# EAGLE design xdac_A (EAGLE 7.7.0)
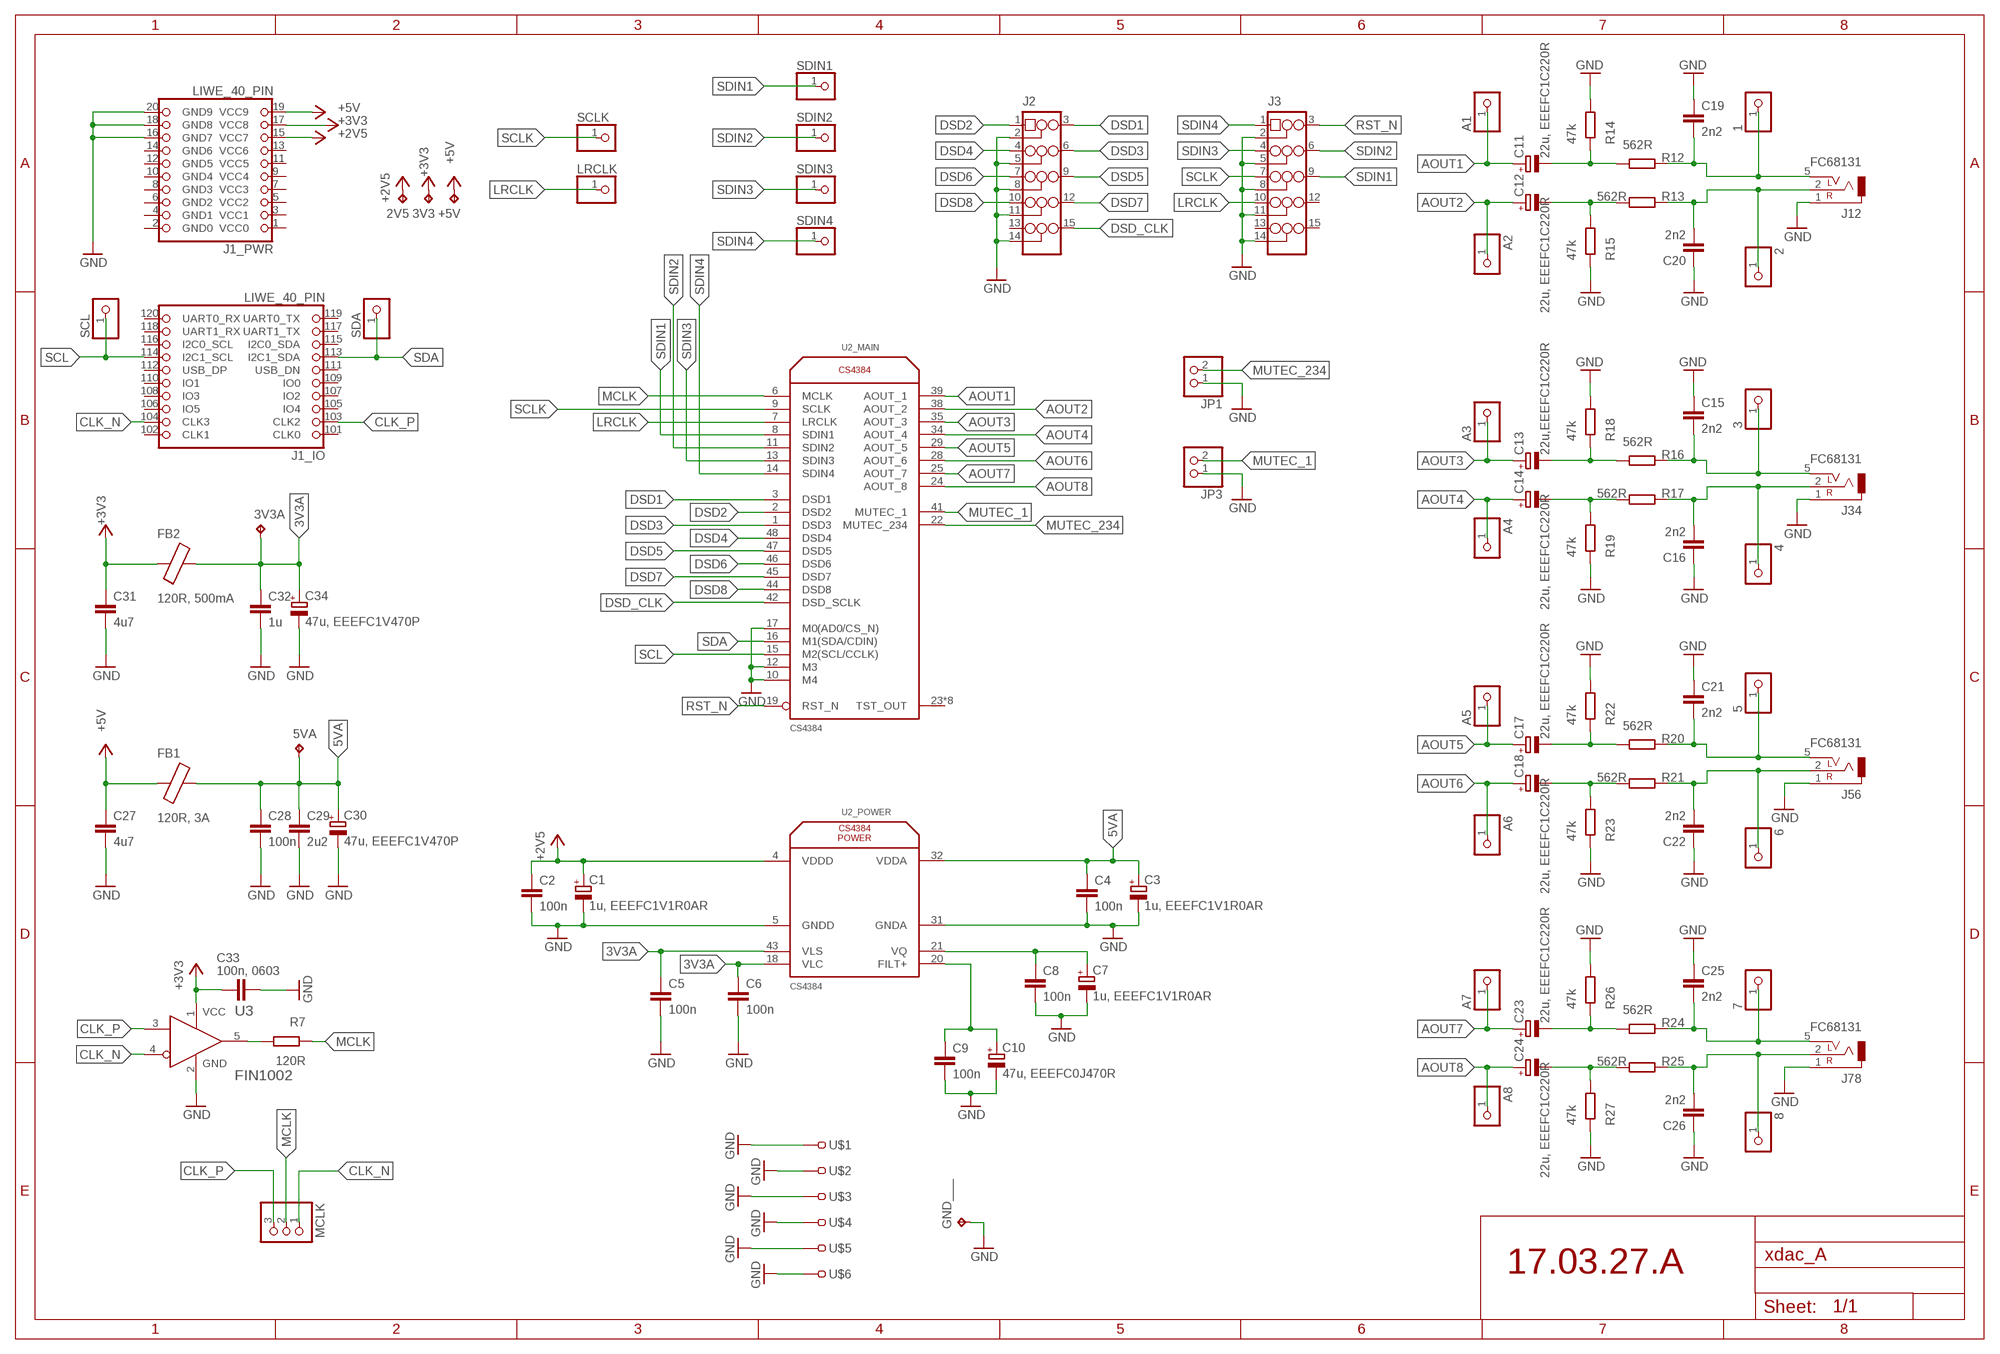
[diagram p0: schematic, sheet 1]

## Parts
1  PINHD-1X1  [1X01]
2  PINHD-1X1  [1X01]
2V5  TPTP14R  [TP14R]
3  PINHD-1X1  [1X01]
3V3  TPTP14R  [TP14R]
3V3A  TPTP14R  [TP14R]
4  PINHD-1X1  [1X01]
5  PINHD-1X1  [1X01]
5VA  TPTP14R  [TP14R]
6  PINHD-1X1  [1X01]
7  PINHD-1X1  [1X01]
8  PINHD-1X1  [1X01]
+5V  TPTP14R  [TP14R]
A1  PINHD-1X1  [1X01]
A2  PINHD-1X1  [1X01]
A3  PINHD-1X1  [1X01]
A4  PINHD-1X1  [1X01]
A5  PINHD-1X1  [1X01]
A6  PINHD-1X1  [1X01]
A7  PINHD-1X1  [1X01]
A8  PINHD-1X1  [1X01]
C1  1u, EEEFC1V1R0AR  C-POL_B  [EEE-FC1V1R0AR]
C2  100n  C-EUC0603  [C0603]
C3  1u, EEEFC1V1R0AR  C-POL_B  [EEE-FC1V1R0AR]
C4  100n  C-EUC0603  [C0603]
C5  100n  C-EUC0603  [C0603]
C6  100n  C-EUC0603K  [C0603K]
C7  1u, EEEFC1V1R0AR  C-POL_B  [EEE-FC1V1R0AR]
C8  100n  C-EUC0603  [C0603]
C9  100n  C-EUC0603  [C0603]
C10  47u, EEEFC0J470R  C-POL_C  [EEE-FC1C220R]
C11  22u, EEEFC1C220R  C-POL_C  [EEE-FC1C220R]
C12  22u, EEEFC1C220R  C-POL_C  [EEE-FC1C220R]
C13  22u,EEEFC1C220R  C-POL_C  [EEE-FC1C220R]
C14  22u, EEEFC1C220R  C-POL_C  [EEE-FC1C220R]
C15  2n2  C-EUC0603  [C0603]
C16  2n2  C-EUC0603  [C0603]
C17  22u, EEEFC1C220R  C-POL_C  [EEE-FC1C220R]
C18  22u, EEEFC1C220R  C-POL_C  [EEE-FC1C220R]
C19  2n2  C-EUC0603  [C0603]
C20  2n2  C-EUC0603  [C0603]
C21  2n2  C-EUC0603  [C0603]
C22  2n2  C-EUC0603  [C0603]
C23  22u, EEEFC1C220R  C-POL_C  [EEE-FC1C220R]
C24  22u, EEEFC1C220R  C-POL_C  [EEE-FC1C220R]
C25  2n2  C-EUC0603  [C0603]
C26  2n2  C-EUC0603  [C0603]
C27  4u7  C-EUC0603K  [C0603K]
C28  100n  C-EUC0603K  [C0603K]
C29  2u2  C-EUC0603K  [C0603K]
C30  47u, EEEFC1V470P  C-POL_E  [EEE-FC1V470P]
C31  4u7  C-EUC0603K  [C0603K]
C32  1u  C-EUC0603K  [C0603K]
C33  100n, 0603  C-EUC0603  [C0603]
C34  47u, EEEFC1V470P  C-POL_E  [EEE-FC1V470P]
FB1  120R, 3A  FB_0603  [L0603]
FB2  120R, 500mA  FB_0603  [L0603]
GND___  TPTP14R  [TP14R]
J1  LIWE_40_PIN  [LIWE_40_PIN_8X8]
J2  PINHD-3X5/90  [3X05/90]
J3  PINHD-3X5/90  [3X05/90]
J12  FC68131  JACK_3.5_3P  [FC68131]
J34  FC68131  JACK_3.5_3P  [FC68131]
J56  FC68131  JACK_3.5_3P  [FC68131]
J78  FC68131  JACK_3.5_3P  [FC68131]
JP1  PINHD-1X2/90  [1X02/90]
JP3  PINHD-1X2/90  [1X02/90]
LRCLK  PINHD-1X1  [1X01]
MCLK  PINHD-1X3  [1X03]
R7  120R  R-EU_R0603  [R0603]
R12  562R  R-EU_R0603  [R0603]
R13  562R  R-EU_R0603  [R0603]
R14  47k  R-EU_R0603  [R0603]
R15  47k  R-EU_R0603  [R0603]
R16  562R  R-EU_R0603  [R0603]
R17  562R  R-EU_R0603  [R0603]
R18  47k  R-EU_R0603  [R0603]
R19  47k  R-EU_R0603  [R0603]
R20  562R  R-EU_R0603  [R0603]
R21  562R  R-EU_R0603  [R0603]
R22  47k  R-EU_R0603  [R0603]
R23  47k  R-EU_R0603  [R0603]
R24  562R  R-EU_R0603  [R0603]
R25  562R  R-EU_R0603  [R0603]
R26  47k  R-EU_R0603  [R0603]
R27  47k  R-EU_R0603  [R0603]
SCL  PINHD-1X1  [1X01]
SCLK  PINHD-1X1  [1X01]
SDA  PINHD-1X1  [1X01]
SDIN1  PINHD-1X1  [1X01]
SDIN2  PINHD-1X1  [1X01]
SDIN3  PINHD-1X1  [1X01]
SDIN4  PINHD-1X1  [1X01]
U2  CS4384  [LQFP_48]
U3  FIN1002  [SOT95P280X140-5N]
U$1  TEST-22-MULTICOMP  [TEST_1MM]
U$2  TEST-22-MULTICOMP  [TEST_1MM]
U$3  TEST-22-MULTICOMP  [TEST_1MM]
U$4  TEST-22-MULTICOMP  [TEST_1MM]
U$5  TEST-22-MULTICOMP  [TEST_1MM]
U$6  TEST-22-MULTICOMP  [TEST_1MM]

## Nets
3V3A: 3V3A.TP C5.1 C6.1 C32.1 C34.1(+) FB2.1 U2.18(_POWER:VLC) U2.43(_POWER:VLS)
5VA: 5VA.TP C3.1(+) C4.1 C28.1 C29.1 C30.1(+) FB1.1 U2.32(_POWER:VDDA)
+2V5: 2V5.TP C1.1(+) C2.1 J1.15(_PWR:VCC7) U2.4(_POWER:VDDD)
+3V3: 3V3.TP C31.1 C33.2 FB2.2 J1.17(_PWR:VCC8) U3.1(VCC)
+5V: +5V.TP C27.1 FB1.2 J1.19(_PWR:VCC9)
AOUT1: A1.1 C11.1(+) U2.39(_MAIN:AOUT_1)
AOUT2: A2.1 C12.1(+) U2.38(_MAIN:AOUT_2)
AOUT2_: 2.1 C20.2 J12.2 R13.2
AOUT3: A3.1 C13.1(+) U2.35(_MAIN:AOUT_3)
AOUT3_: 3.1 C15.2 J34.5 R16.2
AOUT4: A4.1 C14.1(+) U2.34(_MAIN:AOUT_4)
AOUT4_: 4.1 C16.2 J34.2 R17.2
AOUT5: A5.1 C17.1(+) U2.29(_MAIN:AOUT_5)
AOUT5_: 5.1 C21.2 J56.5 R20.2
AOUT6: A6.1 C18.1(+) U2.28(_MAIN:AOUT_6)
AOUT6_: 6.1 C22.2 J56.2 R21.2
AOUT7: A7.1 C23.1(+) U2.25(_MAIN:AOUT_7)
AOUT7_: 7.1 C25.2 J78.5 R24.2
AOUT8: A8.1 C24.1(+) U2.24(_MAIN:AOUT_8)
AOUT8_: 8.1 C26.2 J78.2 R25.2
AUOT1_: 1.1 C19.2 J12.5 R12.2
CLK_N: J1.104(_IO:CLK3) MCLK.1 U3.4(RIN-)
CLK_P: J1.103(_IO:CLK2) MCLK.3 U3.3(RIN+)
DSD1: J2.3 U2.3(_MAIN:DSD1)
DSD2: J2.1 U2.2(_MAIN:DSD2)
DSD3: J2.6 U2.1(_MAIN:DSD3)
DSD4: J2.4 U2.48(_MAIN:DSD4)
DSD5: J2.9 U2.47(_MAIN:DSD5)
DSD6: J2.7 U2.46(_MAIN:DSD6)
DSD7: J2.12 U2.45(_MAIN:DSD7)
DSD8: J2.10 U2.44(_MAIN:DSD8)
DSD_CLK: J2.15 U2.42(_MAIN:DSD_SCLK)
FILT+: C9.1 C10.1(+) U2.20(_POWER:FILT+)
GND: C1.2(-) C2.2 C3.2(-) C4.2 C5.2 C6.2 C7.2(-) C8.2 C9.2 C10.2(-) C15.1 C16.1 C19.1 C20.1 C21.1 C22.1 C25.1 C26.1 C27.2 C28.2 C29.2 C30.2(-) C31.2 C32.2 C33.1 C34.2(-) GND___.TP J1.16(_PWR:GND7) J1.18(_PWR:GND8) J1.20(_PWR:GND9) J2.2 J2.5 J2.8 J2.11 J2.14 J3.2 J3.5 J3.8 J3.11 J3.14 J12.1 J34.1 J56.1 J78.1 JP1.1 JP3.1 R14.2 R15.1 R18.2 R19.1 R22.2 R23.1 R26.2 R27.1 U2.5(_POWER:GNDD) U2.10(_MAIN:M4) U2.12(_MAIN:M3) U2.17(_MAIN:M0(AD0/CS_N)) U2.31(_POWER:GNDA) U3.2(GND) U$1.1 U$2.1 U$3.1 U$4.1 U$5.1 U$6.1
LRCLK: J3.10 LRCLK.1 U2.7(_MAIN:LRCLK)
MCLK: MCLK.2 R7.1 U2.6(_MAIN:MCLK)
MUTEC_1: JP3.2 U2.41(_MAIN:MUTEC_1)
MUTEC_234: JP1.2 U2.22(_MAIN:MUTEC_234)
N$7: R7.2 U3.5(ROUT)
N$15: C11.2(-) R12.1 R14.1
N$16: C12.2(-) R13.1 R15.2
N$27: C13.2(-) R16.1 R18.1
N$28: C14.2(-) R17.1 R19.2
N$33: C17.2(-) R20.1 R22.1
N$34: C18.2(-) R21.1 R23.2
N$39: C23.2(-) R24.1 R26.1
N$40: C24.2(-) R25.1 R27.2
RST_N: J3.3 U2.19(_MAIN:RST_N)
SCL: J1.114(_IO:I2C1_SCL) SCL.1 U2.15(_MAIN:M2(SCL/CCLK))
SCLK: J3.7 SCLK.1 U2.9(_MAIN:SCLK)
SDA: J1.113(_IO:I2C1_SDA) SDA.1 U2.16(_MAIN:M1(SDA/CDIN))
SDIN1: J3.9 SDIN1.1 U2.8(_MAIN:SDIN1)
SDIN2: J3.6 SDIN2.1 U2.11(_MAIN:SDIN2)
SDIN3: J3.4 SDIN3.1 U2.13(_MAIN:SDIN3)
SDIN4: J3.1 SDIN4.1 U2.14(_MAIN:SDIN4)
VQ: C7.1(+) C8.1 U2.21(_POWER:VQ)
Unconnected: J1.1(_PWR:VCC0) J1.2(_PWR:GND0) J1.3(_PWR:VCC1) J1.4(_PWR:GND1) J1.5(_PWR:VCC2) J1.6(_PWR:GND2) J1.7(_PWR:VCC3) J1.8(_PWR:GND3) J1.9(_PWR:VCC4) J1.10(_PWR:GND4) J1.11(_PWR:VCC5) J1.12(_PWR:GND5) J1.13(_PWR:VCC6) J1.14(_PWR:GND6) J1.101(_IO:CLK0) J1.102(_IO:CLK1) J1.105(_IO:IO4) J1.106(_IO:IO5) J1.107(_IO:IO2) J1.108(_IO:IO3) J1.109(_IO:IO0) J1.110(_IO:IO1) J1.111(_IO:USB_DN) J1.112(_IO:USB_DP) J1.115(_IO:I2C0_SDA) J1.116(_IO:I2C0_SCL) J1.117(_IO:UART1_TX) J1.118(_IO:UART1_RX) J1.119(_IO:UART0_TX) J1.120(_IO:UART0_RX) J2.13 J3.12 J3.13 J3.15 U2.23(_MAIN:TST_OUT) U2.26(_MAIN:TST_OUT) U2.27(_MAIN:TST_OUT) U2.30(_MAIN:TST_OUT) U2.33(_MAIN:TST_OUT) U2.36(_MAIN:TST_OUT) U2.37(_MAIN:TST_OUT) U2.40(_MAIN:TST_OUT)

## Notes on the sheet
- 17.03.27.A

## Library data of the parts
1-8 A1-A8 LRCLK SCL SCLK SDA SDIN1-SDIN4 = 25pinhead:PINHD-1X1: PIN HEADER
2V5 3V3 3V3A 5VA +5V GND___ = testpad:TP: Test pad
C1 C3 C7 C10-C14 C17 C18 C23 C24 C30 C34 = 25cmsquare:C-POL: Panasonic Alluminium Electrolytic Capacitors / FC Series: FC Type: V http://www.farnell.com/datasheets/2059994.pdf?_ga=1.187970088.1293831445.1473845555
C2 C4-C6 C8 C9 C15 C16 C19-C22 C25-C29 C31-C33 = rcl:C-EU: CAPACITOR, European symbol
FB1 FB2 = 25cmsquare:FB
J1 = 25cmsquare:LIWE_40_PIN
J2 J3 = 25pinhead:PINHD-3X5
J12 J34 J56 J78 = 25cmsquare:JACK_3.5_3P: CLIFF 3.5mm STEREO PC JACK SOCKET http://www.farnell.com/datasheets/2028381.pdf?_ga=1.192560682.1293831445.1473845555
JP1 JP3 = 25pinhead:PINHD-1X2: PIN HEADER
MCLK = 25pinhead:PINHD-1X3: PIN HEADER
R7 R12-R27 = rcl:R-EU_: RESISTOR, European symbol
U2 = 25cmsquare:CS4384
U3 = 25cmsquare:FIN1002
U$1-U$6 = 25cmsquare:TEST-22-MULTICOMP: MULTICOMP TEST-22 TEST PIN, PCB, 1.0MM FARNELL: 1702010

## Board
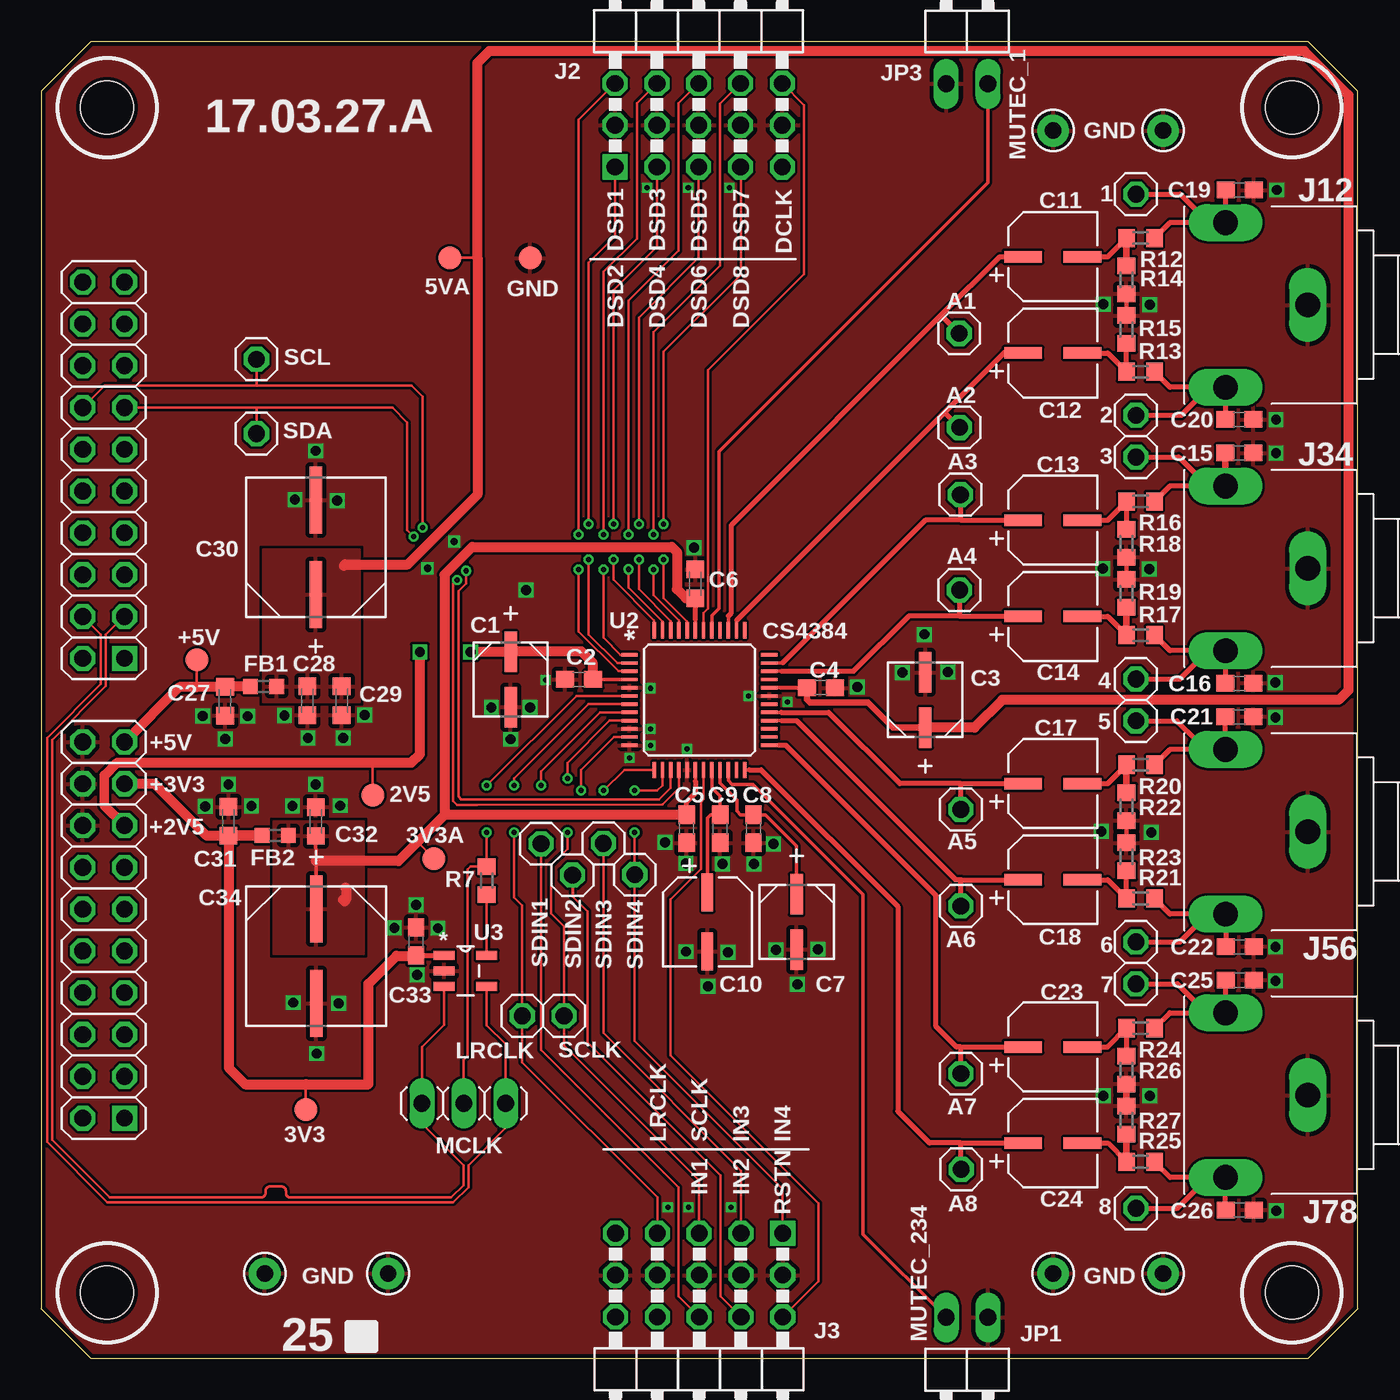
[diagram p1: board, top side]
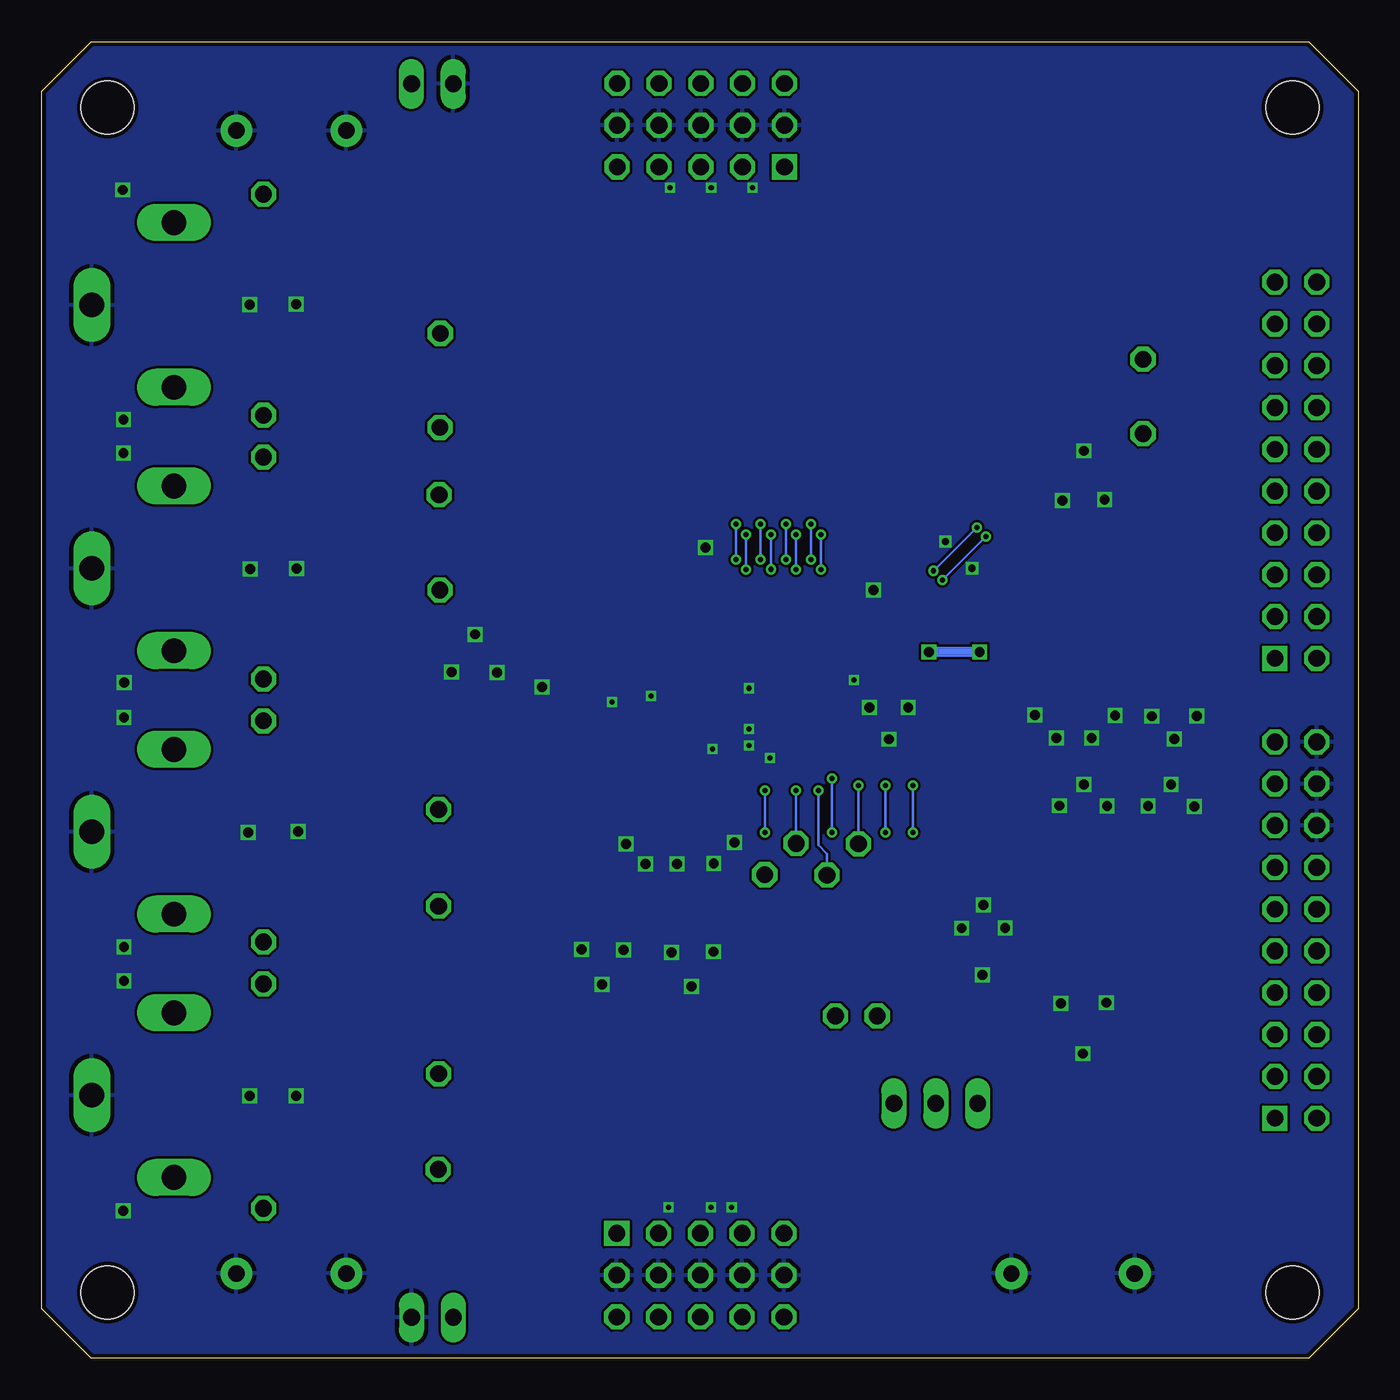
[diagram p2: board, bottom side, seen from below]

Size 80 x 80 mm. Coordinates in mm from the lower left corner, seen from the top.
Copper layers (1*16): Top 0.035mm / dielectric 1.5mm / Bottom 0.035mm
Design rules "SeeedStudio_2layer_DRU_no_angle_20140221": minimum track width 6mil, minimum drill 12mil, track to track 6mil, track to pad 6mil, pad to pad 6mil, via to via 6mil, smd to smd 0mil, copper to edge 10mil, drill to drill 10mil, minimum pad ring 10mil, minimum via ring 6mil, stop-mask expansion 2mil, vias tented up to drill 100mil, thermal gap 10mil

### Footprints (pad centres in the part's own frame; a part is rotated, then mirrored left to right if it is on the bottom)
1X01 = drill 1.016 octagon: 1 0,0
TP14R = smd 1.4 x 1.4: TP 0,0
EEE-FC1V1R0AR = smd 2.464 x 0.762: 1 -1.676,0; 2 1.676,0
C0603 = smd 1.1 x 1: 1 -0.85,0; 2 0.85,0
C0603K = smd 1.05 x 1.08: 1 -0.875,0; 2 0.875,0
EEE-FC1C220R = smd 2.3 x 0.7: 1 -1.8,0; 2 1.8,0
EEE-FC1V470P = smd 4.064 x 0.762: 1 -2.87,0; 2 2.87,0
L0603 = smd 0.9 x 0.9: 1 -0.8,0; 2 0.8,0
LIWE_40_PIN_8X8 = drill 1.016 square: 1 74.93,65.405; 101 74.93,37.465 | drill 1.016 octagon: 2 77.47,65.405; 3 74.93,62.865; 4 77.47,62.865; 5 74.93,60.325; 6 77.47,60.325; 7 74.93,57.785; 8 77.47,57.785; 9 74.93,55.245; 10 77.47,55.245; 11 74.93,52.705; 12 77.47,52.705; 13 74.93,50.165; 14 77.47,50.165; 15 74.93,47.625; 16 77.47,47.625; 17 74.93,45.085; 18 77.47,45.085; 19 74.93,42.545; 20 77.47,42.545; 102 77.47,37.465; 103 74.93,34.925; 104 77.47,34.925; 105 74.93,32.385; 106 77.47,32.385; 107 74.93,29.845; 108 77.47,29.845; 109 74.93,27.305; 110 77.47,27.305; 111 74.93,24.765; 112 77.47,24.765; 113 74.93,22.225; 114 77.47,22.225; 115 74.93,19.685; 116 77.47,19.685; 117 74.93,17.145; 118 77.47,17.145; 119 74.93,14.605; 120 77.47,14.605 | hole 3.2: 4,76; 4,4; 76,4; 76,76
3X05/90 = drill 1.016 square: 1 -5.08,-7.62 | drill 1.016 octagon: 2 -5.08,-5.08; 3 -5.08,-2.54; 4 -2.54,-7.62; 5 -2.54,-5.08; 6 -2.54,-2.54; 7 0,-7.62; 8 0,-5.08; 9 0,-2.54; 10 2.54,-7.62; 11 2.54,-5.08; 12 2.54,-2.54; 13 5.08,-7.62; 14 5.08,-5.08; 15 5.08,-2.54
FC68131 = drill 1.5 long: 1 0,0; 2 5,5; 5 5,-5
1X02/90 = drill 1.016 long: 1 -1.27,-3.81; 2 1.27,-3.81
1X03 = drill 1.016 long: 1 -2.54,0; 2 0,0; 3 2.54,0
R0603 = smd 1 x 1.1: 1 -0.85,0; 2 0.85,0
LQFP_48 = smd 0.2 x 1: 1 -2.75,-4.25; 2 -2.25,-4.25; 3 -1.75,-4.25; 4 -1.25,-4.25; 5 -0.75,-4.25; 6 -0.25,-4.25; 7 0.25,-4.25; 8 0.75,-4.25; 9 1.25,-4.25; 10 1.75,-4.25; 11 2.25,-4.25; 12 2.75,-4.25; 25 2.75,4.25; 26 2.25,4.25; 27 1.75,4.25; 28 1.25,4.25; 29 0.75,4.25; 30 0.25,4.25; 31 -0.25,4.25; 32 -0.75,4.25; 33 -1.25,4.25; 34 -1.75,4.25; 35 -2.25,4.25; 36 -2.75,4.25 | smd 1 x 0.2: 13 4.25,-2.75; 14 4.25,-2.25; 15 4.25,-1.75; 16 4.25,-1.25; 17 4.25,-0.75; 18 4.25,-0.25; 19 4.25,0.25; 20 4.25,0.75; 21 4.25,1.25; 22 4.25,1.75; 23 4.25,2.25; 24 4.25,2.75; 37 -4.25,2.75; 38 -4.25,2.25; 39 -4.25,1.75; 40 -4.25,1.25; 41 -4.25,0.75; 42 -4.25,0.25; 43 -4.25,-0.25; 44 -4.25,-0.75; 45 -4.25,-1.25; 46 -4.25,-1.75; 47 -4.25,-2.25; 48 -4.25,-2.75
SOT95P280X140-5N = smd 1.27 x 0.559: 1 -1.295,0.94; 2 -1.295,0; 3 -1.295,-0.94; 4 1.295,-0.94; 5 1.295,0.94
TEST_1MM = drill 1 pad 1.93: 1 0,0

### Placement (x,y rotation side)
1  66.52,70.74 0 top
2  66.52,57.3 0 top
2V5  20.17,34.21 0 top
3  66.52,54.76 0 top
3V3  16.08,15.11 0 top
3V3A  23.85,30.35 0 top
4  66.52,41.27 0 top
5  66.52,38.73 0 top
5VA  24.84,66.88 0 top
6  66.52,25.3 0 top
7  66.52,22.76 0 top
8  66.52,9.12 0 top
+5V  9.47,42.44 0 top
A1  55.78,62.28 0 top
A2  55.8,56.57 0 top
A3  55.85,52.48 0 top
A4  55.8,46.69 0 top
A5  55.88,33.35 0 top
A6  55.88,27.48 0 top
A7  55.88,17.3 0 top
A8  55.91,11.48 0 top
C1  28.52,41.25 270 top
C2  32.69,41.25 180 top
C3  53.72,40.01 90 top
C4  47.37,40.74 0 top
C5  39.22,32.18 270 top
C6  39.75,47.07 90 top
C7  45.9,26.52 270 top
C8  43.28,32.18 270 top
C9  41.25,32.18 270 top
C10  40.49,26.52 270 top
C11  61.47,66.93 0 top
C12  61.47,61.09 0 top
C13  61.47,50.93 0 top
C14  61.47,45.09 0 top
C15  72.8,55.02 180 top
C16  72.8,41.02 180 top
C17  61.47,34.92 0 top
C18  61.47,29.08 0 top
C19  72.82,70.99 180 top
C20  72.8,57.05 180 top
C21  72.8,38.99 180 top
C22  72.82,25.02 180 top
C23  61.47,18.92 0 top
C24  61.47,13.08 0 top
C25  72.82,22.99 180 top
C26  72.82,9.02 180 top
C27  11.18,39.93 270 top
C28  16.18,39.95 270 top
C29  18.26,39.95 270 top
C30  16.69,49.28 90 top
C31  11.38,32.64 90 top
C32  16.69,32.61 90 top
C33  22.78,25.32 270 top
C34  16.71,24.43 270 top
FB1  13.51,40.82 180 top
FB2  14.22,31.78 180 top
GND___  29.72,66.85 0 top
J1  80,80 180 top
J2  39.95,80.01 0 top
J3  39.98,-0.03 180 top
J12  76.96,64.01 180 top
J34  76.96,48 180 top
J56  76.96,32 180 top
J78  76.96,15.99 180 top
JP1  56.26,-1.32 180 top
JP3  56.26,81.25 0 top
LRCLK  29.24,20.8 0 top
MCLK  25.68,15.49 180 top
R7  27.08,29.03 270 top
R12  66.8,68.07 0 top
R13  66.8,59.94 0 top
R14  65.94,65.53 270 top
R15  65.94,62.51 270 top
R16  66.8,52.07 0 top
R17  66.8,43.94 0 top
R18  65.94,49.53 270 top
R19  65.94,46.48 270 top
R20  66.8,36.07 0 top
R21  66.8,27.94 0 top
R22  65.94,33.53 270 top
R23  65.94,30.48 270 top
R24  66.8,20.07 0 top
R25  66.8,11.94 0 top
R26  65.94,17.53 270 top
R27  65.94,14.48 270 top
SCL  13.08,60.71 0 top
SCLK  31.78,20.8 0 top
SDA  13.08,56.18 0 top
SDIN1  30.38,31.27 0 top
SDIN2  32.28,29.36 0 top
SDIN3  34.16,31.29 0 top
SDIN4  36.07,29.39 0 top
U2  40,40 270 top
U3  25.78,23.55 0 top
U$1  68.17,5.16 0 top
U$2  61.49,5.16 0 top
U$3  68.17,74.6 0 top
U$4  61.49,74.6 0 top
U$5  13.59,5.16 0 top
U$6  21.08,5.16 0 top

### Tracks (layer width: path | path; a pad name or v marks a point on that pad's centre or on a via)
3V3A
  Top 0.152: 3V3A.TP 23.85,30.38 22.86,31.37
  Top 0.203: C34.1 16.71,28.57 16.7,30.22 C32.1 | C5.1 39.18,32.99 | U2.18 39.75,35.08 | U2.43 39.75,44.91
  Top 0.305: C5.1 39.22,33.81 39.75,34.34 39.75,35.08 | 39.75,44.91 C6.1
  Top 0.61: C6.1 39.18,46.19 38.63,46.74 38.63,49 38.33,49.3 26.19,49.3 24.51,47.62 24.51,33.02 | C5.1 39.21,33.02 24.51,33.02 | 16.71,28.57 | 18.49,28.6 18.52,28.57 18.52,27.86 18.44,27.79 18.41,27.79 18.34,27.86 | 24.51,33.02 22.86,31.37 21.71,30.22 16.7,30.22
  pour Top: 14.12,32.61 19.58,32.61 19.58,24.56 14.12,24.56
5VA
  Top 0.152: 5VA.TP 26.52,66.88
  Top 0.203: C4.1 46.13,40.75 | U2.32 44.94,40.75
  Top 0.254: 44.94,40.75 46.13,40.75 arc-90 C4.1
  Top 0.406: C3.1 51.77,38.33 50.24,39.85 46.71,39.85 46.53,40.03 46.53,40.73 C4.1 46.15,40.73
  Top 0.61: C3.1 56.72,38.33 58.4,40.01 78.84,40.01 79.43,40.59 79.43,76.76 76.76,79.43 27.23,79.43 26.52,78.72 26.52,66.88 26.52,52.48 22.28,48.23 18.47,48.23 18.39,48.16
  pour Top: 13.49,39.88 19.35,39.88 19.35,49.15 13.49,49.15
+2V5  (via drill 0.6)
  Top 0.152: 2V5.TP 20.14,34.21 20.14,36.2
  Top 0.203: 28.57,42.98 C1.1 | 33.5,41.29 C2.1 U2.4 | U2.4
  Top 0.584: 3.83,33.6 3.83,35.38
  Top 0.61: 33.5,41.29 33.5,42.29 32.82,42.98 28.57,42.98 | J1.15 3.83,33.6 | 3.83,35.38 3.85,35.4 3.85,35.42 4.63,36.2 20.14,36.2 22.5,36.2 23.01,36.7 v23.01,42.93 | C1.1 v26.09,42.93
  Bottom 0.61: v23.01,42.93 v26.09,42.93
+3V3
  Top 0.152: 3V3.TP 16.08,16.66
  Top 0.305: C33.2 24.47,24.47 U3.1
  Top 0.61: J1.17 6.89,34.91 10.06,31.75 11.37,31.75 C31.1 13.41,31.76 FB2.2 11.4,31.77 11.4,17.65 12.39,16.66 16.08,16.66 19.89,16.66 19.89,22.76 21.59,24.46 C33.2 22.76,24.45
+5V
  Top 0.152: +5V.TP 9.45,42.44 9.45,40.78
  Top 0.203: C27.1
  Top 0.61: J1.19 8.4,40.78 9.45,40.78 11.15,40.78 C27.1 11.19,40.82 FB1.2
AOUT1
  Top 0.203: U2.39 41.75,45.11
  Top 0.254: C11.1 58.7,66.85
  Top 0.305: 41.75,45.11 41.94,45.3 41.94,50.62 54.69,63.37 | C11.1 58.24,66.93 54.69,63.37 | A1.1 54.69,63.37
AOUT2
  Top 0.203: U2.38 42.25,44.84
  Top 0.254: 58.75,61.11 C12.1
  Top 0.305: 54.88,57.47 42.25,44.84 | 54.88,57.47 58.52,61.11 58.75,61.11 | A2.1 54.9,57.47 54.88,57.47
AOUT2_
  Top 0.305: C20.2 71.95,59.01 70.38,59.01 | R13.2 68.59,59.01 70.38,59.01 | 2.1 69.29,57.3 70.38,58.4 70.38,59.01
  Top 0.406: J12.2 71.95,59.01
AOUT3
  Top 0.203: U2.35 45.04,42.25 45.06,42.27
  Top 0.254: C13.1 58.65,50.8
  Top 0.305: 45.06,42.27 53.72,50.93 55.91,50.93 | 55.91,50.93 C13.1 | A3.1 55.85,50.98 55.91,50.93
AOUT3_
  Top 0.305: R16.2 68.58,53 70.36,53 | 70.36,53 J34.5 | 3.1 69.11,54.76 70.36,53.52 70.36,53
  Top 0.406: C15.2 J34.5
AOUT4
  Top 0.203: U2.34 44.99,41.75
  Top 0.254: 58.75,45.11 C14.1
  Top 0.305: 44.99,41.75 49.37,41.75 52.73,45.11 55.78,45.11 | 55.78,45.11 58.75,45.11 | A4.1 55.8,45.14 55.78,45.11
AOUT4_
  Top 0.305: R17.2 68.59,43 70.33,43 | 70.33,43 J34.2 | 71.95,42.99 C16.2 | 4.1 69.19,41.27 70.33,42.42 70.33,43
  Top 0.406: J34.2 71.95,42.99
AOUT5
  Top 0.203: U2.29 44.96,39.25
  Top 0.305: 44.96,39.25 47.85,39.25 52.17,34.92 55.88,34.92 | 55.88,34.92 C17.1 | A5.1 55.88,34.92
AOUT5_
  Top 0.305: R20.2 68.58,37 70.21,37 | 70.21,37 J56.5 | 71.95,37.01 C21.2 | 5.1 69.01,38.73 70.21,37.54 70.21,37
  Top 0.406: J56.5 71.95,37.01
AOUT6
  Top 0.203: U2.28 44.98,38.75
  Top 0.305: 55.91,29.08 55.58,29.08 45.91,38.75 44.98,38.75 | 55.91,29.08 C18.1 | A6.1 55.88,29.06 55.91,29.08
AOUT6_
  Top 0.305: 71.97,27 C22.2 | R21.2 68.59,27 70.26,27 | 70.26,27 J56.2 | 6.1 69.19,25.3 70.26,26.36 70.26,27
  Top 0.406: J56.2 71.97,27
AOUT7
  Top 0.203: U2.25 44.82,37.25
  Top 0.305: 44.82,37.25 45.25,37.25 54.38,28.12 54.38,20.17 55.63,18.92 55.88,18.92 | 55.88,18.92 C23.1 | A7.1 55.88,18.92
AOUT7_
  Top 0.305: C25.2 J78.5 | R24.2 68.58,20.99 70.4,20.99 70.28,21.11 70.28,21.51 69.04,22.76 7.1
  Top 0.406: 70.4,20.99 J78.5 | C25.2
AOUT8
  Top 0.203: U2.24 42.76,35.76 43.03,35.76
  Top 0.305: 43.03,35.76 43.74,35.76 52.05,27.46 52.05,15.01 53.98,13.08 55.88,13.08 | 55.88,13.08 C24.1 | A8.1 55.88,11.51 55.88,13.08
AOUT8_
  Top 0.305: R25.2 68.6,10.99 70.28,10.99 | 70.28,10.99 J78.2 C26.2 | 8.1 69.04,9.12 70.28,10.36 70.28,10.99
  Top 0.406: C26.2
AUOT1_
  Top 0.305: R12.2 68.59,69.01 70.43,69.01 | 70.43,69.01 J12.5 | 71.97,69.02 C19.2 | 1.1 69.22,70.74 70.38,69.57 70.38,69.06 70.43,69.01
  Top 0.406: R12.2 | J12.5 71.97,69.02
CLK_N
  Top 0.152: J1.104 2.55,45.08 3.63,43.99 3.63,40.98 0.36,37.71 0.36,13.14 4.03,9.47 25.03,9.47 25.96,10.4 25.96,11.73 28.22,13.99 MCLK.1 28.22,19.1 27.08,20.24 U3.4
CLK_P
  Top 0.152: J1.103 5.02,45.08 3.94,43.99 3.94,40.86 0.66,37.58 0.66,13.27 4.15,9.78 13.37,9.78 arc90 13.64,10.05 13.64,10.18 arc-90 13.9,10.45 14.61,10.45 arc-90 14.87,10.18 14.87,10.05 arc90 15.14,9.78 24.91,9.78 25.65,10.53 25.65,11.73 23.14,14.25 MCLK.3 23.14,18.92 24.49,20.27 U3.3
DSD1  (via drill 0.3)
  Top 0.152: U2.3 35.09,41.75 32.66,44.17 v32.66,47.92 | J2.3 32.66,75.26 v32.66,50.06
  Bottom 0.152: v32.66,47.92 v32.66,50.06
DSD2  (via drill 0.3)
  Top 0.152: 35.73,42.27 U2.2 35.02,42.25 33.27,43.99 v33.27,48.54 | v33.27,50.7 33.27,66.57 34.87,68.17 J2.1
  Bottom 0.152: v33.27,48.54 v33.27,50.7
DSD3  (via drill 0.3)
  Top 0.152: U2.1 35.2,42.75 34.16,43.79 v34.16,47.92 | v34.16,50.06 34.16,66.02 36.2,68.05 36.2,76.25 J2.6
  Bottom 0.152: v34.16,47.92 v34.16,50.06
DSD4  (via drill 0.3)
  Top 0.152: 37.24,44.26 U2.48 37.25,44.84 34.77,47.32 v34.77,48.54 | v34.77,50.7 34.77,64.9 37.41,67.54 J2.4
  Bottom 0.152: v34.77,48.54 v34.77,50.7
DSD5  (via drill 0.3)
  Top 0.152: U2.47 37.75,44.77 35.69,46.84 v35.69,47.94 | v35.69,50.06 35.69,64.26 38.73,67.31 38.73,76.25 J2.9
  Bottom 0.152: v35.69,47.94 v35.69,50.06
DSD6  (via drill 0.3)
  Top 0.152: U2.46 38.25,44.81 36.32,46.74 v36.32,48.54 | v36.32,50.7 36.32,63.25 39.95,66.88 J2.7
  Bottom 0.152: v36.32,48.54 v36.32,50.7
DSD7  (via drill 0.3)
  Top 0.152: U2.45 38.75,44.84 37.21,46.38 v37.21,47.92 | 42.49,77.44 J2.12 41.25,76.22 41.25,66.4 37.21,62.36 v37.21,50.06
  Bottom 0.152: v37.21,47.92 v37.21,50.06
DSD8  (via drill 0.3)
  Top 0.152: U2.44 39.25,44.77 37.82,46.2 v37.82,48.54 | v37.82,50.7 37.82,61.16 42.52,65.86 42.52,72.36 J2.10
  Bottom 0.152: v37.82,48.54 v37.82,50.7
DSD_CLK
  Top 0.152: J2.15 46.35,76.15 46.35,65.89 40.52,60.05 40.52,45.57 40.25,45.3 U2.42
FILT+
  Top 0.203: U2.20 40.75,34.66 41.25,34.16 C9.1 | 41.24,33.02 C9.1 | C9.1 40.68,33.03 40.49,32.84 C10.1
GND  (via drill 0.3, 0.43, 0.6)
  Top 0.254: R14.2 R15.1 | R18.2 R19.1 | R22.2 R23.1 | 77.99,32 J56.1
  Top 0.406: R26.2 R27.1
  other vias: 36.8,71.15 39.32,71.15 41.83,71.15 39.34,9.17 41.91,9.17 38.07,9.17 37.03,40.72 30.66,41.22 37.03,38.25 37.03,37.24 39.24,37.03 42.98,40.23 75.08,70.99 75.03,57.05 75.03,55.02 74.98,41.07 75.01,38.94 75.01,24.99 75.01,22.94 75.06,8.97 67.36,15.95 64.54,15.95 67.46,31.95 64.41,32 67.34,47.96 64.52,47.98 67.36,64.03 64.54,64.06 49.61,40.79 52.32,41.68 53.67,43.99 55.09,41.71 41.73,24.66 44.65,24.82 47.19,24.84 45.95,22.73 39.19,24.71 40.51,22.61 43.31,30.05 41.4,30.05 37.9,31.34 39.67,49.28 35.76,36.47 45.34,39.88 15.27,33.55 18.16,33.58 12.78,33.55 11.38,34.87 9.8,39.04 9.96,33.53 16.69,34.87 11.18,37.64 12.55,39.01 16.21,37.69 18.34,37.69 14.78,39.07 19.66,39.09 15.32,21.62 18.08,21.56 16.74,18.52 16.69,55.14 17.98,52.12 15.42,52.17 27.36,39.55 29.72,39.55 28.52,37.62 22.78,27.56 24.1,26.14 21.46,26.16 22.83,23.29 23.47,48.01 25.1,49.63 44.5,31.27 39.17,30.07 29.46,46.69
  pour Bottom: -0.84,80.47 80.42,80.47 80.42,-0.05 -0.84,-0.05
  pour Top (rank 6): -2.03,81.69 81.2,81.69 81.2,-3.1 -2.03,-3.1
LRCLK  (via drill 0.3)
  Top 0.152: U2.7 33.25,39.75 28.73,35.23 v28.73,34.81 | J3.10 37.44,9.78 29.23,17.98 LRCLK.1 29.23,27.51 28.73,28.02 v28.73,31.95
  Bottom 0.152: v28.73,34.81 v28.73,31.95
MCLK  (via drill 0.3)
  Top 0.152: R7.1 27.07,29.87 | R7.1 v27.08,31.95 | R7.1 27.06,29.9 26.09,29.9 25.91,29.72 25.91,18.36 25.68,18.14 MCLK.2 | v27.08,34.8 32.53,40.25 U2.6
  Bottom 0.152: v27.08,34.8 v27.08,31.95
MUTEC_1
  Top 0.203: U2.41 40.75,45.14 41.17,45.57 41.17,55.09 57.53,71.45 JP3.2
MUTEC_234
  Top 0.152: 41.73,35.73 U2.22
  Top 0.203: U2.22 41.75,35.11 41.99,34.87 43.26,34.87 49.94,28.19 49.94,7.54 JP1.2
N$7
  Top 0.152: U3.5 R7.2
N$15
  Top 0.305: C11.2 64.81,66.93 R12.1
  Top 0.406: 63.75,66.93 C11.2 | R12.1 65.94,68.07 R14.1
N$16
  Top 0.305: 65.95,61.66 R13.1 64.81,61.09 C12.2
  Top 0.406: R15.2 65.95,61.66
N$27
  Top 0.305: 65.94,52.07 R18.1 | C13.2 64.81,50.93 R16.1
  Top 0.406: R16.1 65.94,52.07
N$28
  Top 0.305: C14.2 64.81,45.09 R17.1
  Top 0.406: R19.2 65.95,45.63 R17.1
N$33
  Top 0.305: C17.2 64.81,34.92 R20.1
  Top 0.406: R20.1 65.94,36.07 R22.1
N$34
  Top 0.305: 65.95,29.63 R21.1 64.81,29.08 C18.2
  Top 0.406: R23.2 65.95,29.63
N$39
  Top 0.305: 65.94,20.07 R26.1 | C23.2 64.81,18.92 R24.1
  Top 0.406: R24.1 65.94,20.07
N$40
  Top 0.305: C24.2 64.81,13.08 R25.1
  Top 0.406: R27.2 65.95,13.63 R25.1
RST_N
  Top 0.152: U2.19 40.25,33.98 40.08,33.81 40.08,29.74 38.23,27.89 38.23,18.41 47.22,9.42 47.22,4.67 J3.3
SCL  (via drill 0.3)
  Top 0.152: U2.15 38.25,34.67 37.54,33.96 25.53,33.96 25.35,34.14 25.35,46.61 25.83,47.09 v25.83,47.85 | v23.17,50.48 23.17,58.44 22.5,59.11 13.08,59.11 | J1.114 3.86,59.11 13.08,59.11 | 13.08,59.11 SCL.1
  Bottom 0.152: v25.83,47.85 25.79,47.85 v23.17,50.48
SCLK  (via drill 0.3)
  Top 0.152: U2.9 34.55,38.75 31.98,36.18 v31.98,35.23 | J3.7 39.98,10.82 31.77,19.02 SCLK.1 31.77,26.24 30.99,27.03 30.99,29.97 31.98,30.96 v31.98,31.95
  Bottom 0.152: v31.98,35.23 v31.98,31.95
SDA  (via drill 0.3)
  Top 0.152: U2.16 38.75,34.66 37.74,33.66 26.47,33.63 25.27,33.63 25.04,33.86 25.04,47.07 v25.27,47.3 | 13.08,57.77 21.35,57.77 22.25,56.87 22.25,50.32 v22.63,49.94 | 13.08,57.77 J1.113 | 13.08,57.77 SDA.1
  Bottom 0.152: v25.27,47.3 v22.63,49.94
SDIN1  (via drill 0.3)
  Top 0.152: U2.8 33.97,39.25 30.38,35.66 v30.38,34.8 | J3.9 38.73,3.76 38.73,10.39 30.38,18.75 SDIN1.1
  Bottom 0.152: v30.38,34.8 SDIN1.1
SDIN2  (via drill 0.3)
  Top 0.152: U2.11 34.8,37.75 32.82,35.76 v32.82,34.49 | J3.6 41.27,3.76 41.27,11.12 33.2,19.2 33.2,27.15 32.28,28.07 SDIN2.1 32.31,28.12
  Bottom 0.152: v32.82,34.49 32.82,31.19 32.28,30.66 SDIN2.1
SDIN3  (via drill 0.3)
  Top 0.152: J3.4 42.52,11.4 34.16,19.76 SDIN3.1 | v34.16,34.49 35.43,35.76 37.24,35.76
  Top 0.203: U2.13 37.24,35.76
  Bottom 0.152: v34.16,34.49 SDIN3.1
SDIN4  (via drill 0.3)
  Top 0.152: U2.14 37.75,34.82 37.42,34.49 v36.07,34.49 | J3.1 45.03,7.62 45.03,10.31 36.07,19.28 SDIN4.1 v36.07,31.95
  Bottom 0.152: v36.07,31.95 v36.07,34.49
VQ
  Top 0.152: U2.21
  Top 0.203: U2.21 41.25,34.95 42.27,33.93 42.27,33.25 42.48,33.03 C8.1 43.29,33.02 44.02,33.02 45.9,31.14 C7.1
  Top 0.254: 43.29,33.02 C8.1

### Text on the board
tNames: 17.03.27.A | GND | MUTEC_1 | DSD1 | DSD3 | DSD5 | DSD7 | DCLK | DSD2 | DSD4 | DSD6 | DSD8 | GND | CS4384 | +5V | +3V3 | +2V5 | LRCLK | SCLK | IN3 | IN4 | IN1 | IN2 | RSTN | GND | GND | MUTEC_234 | 25